# Altium project SterUni_V1.PrjPCB
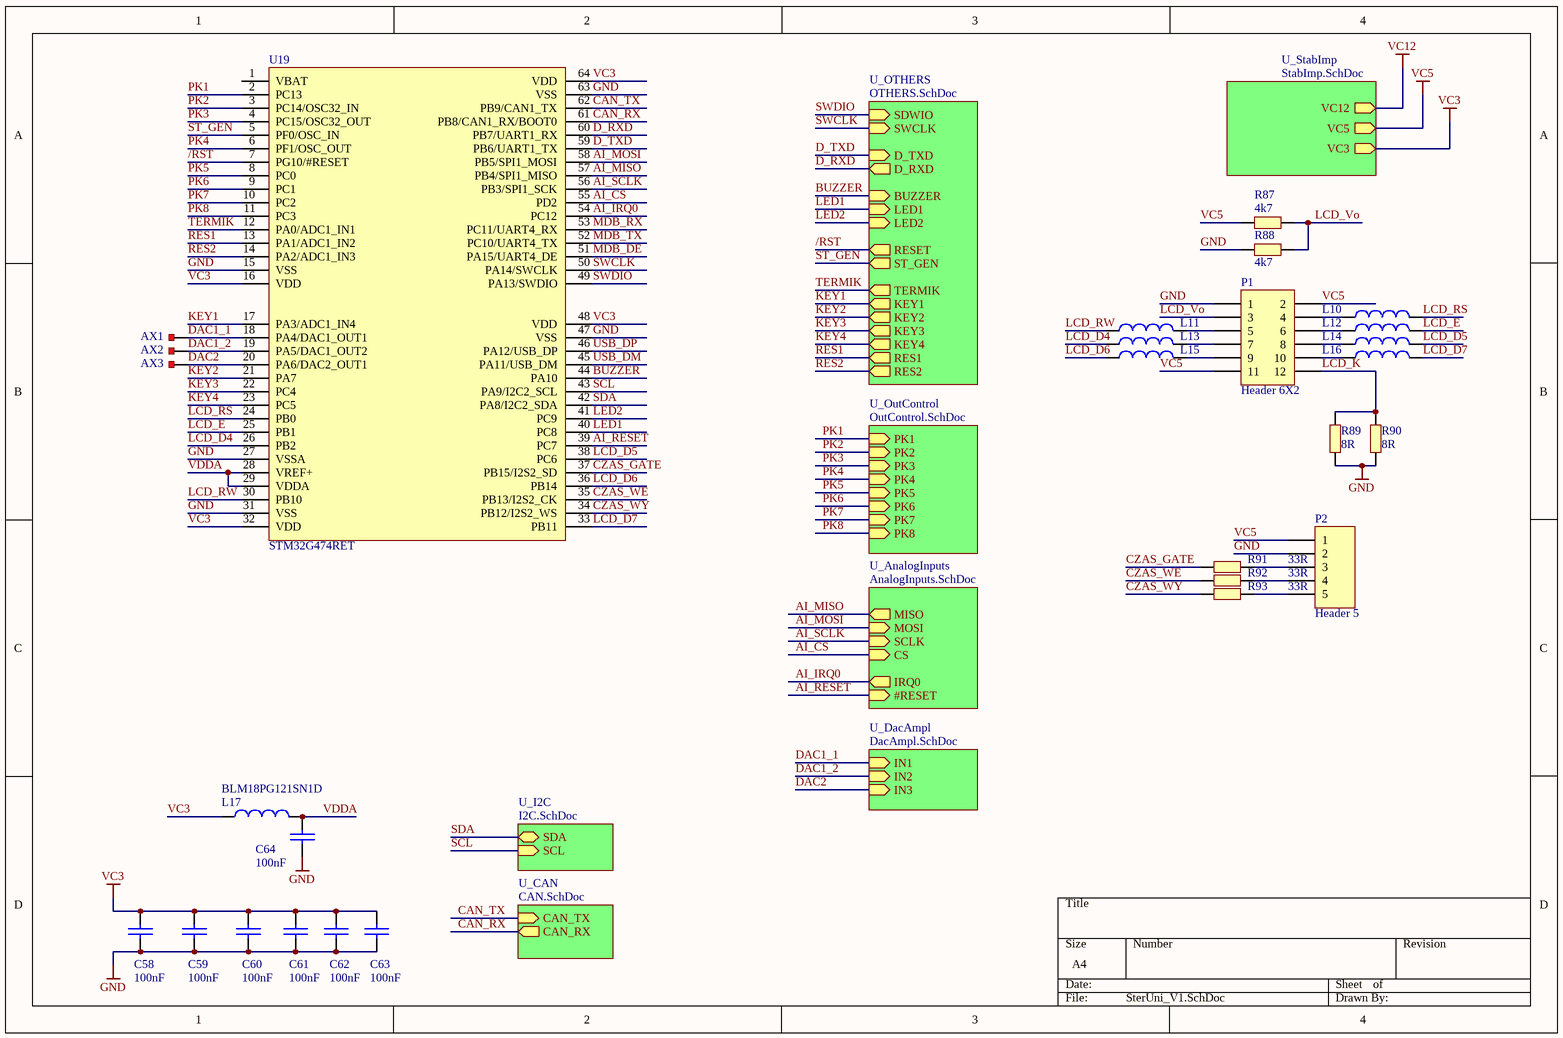
[diagram p0: SterUni_V1.SchDoc]
8 sheets, 255 parts. Net scope: hierarchical (ports join the sheet entries above them; power ports are global).
Board file: SterUni_V1.PcbDoc
Sheets:
  SterUni_V1.SchDoc
    U_OTHERS = OTHERS.SchDoc
    U_OutControl = OutControl.SchDoc
    U_StabImp = StabImp.SchDoc
    U_I2C = I2C.SchDoc
    U_CAN = CAN.SchDoc
    U_AnalogInputs = AnalogInputs.SchDoc
    U_DacAmpl = DacAmpl.SchDoc

## Sheet SterUni_V1.SchDoc
size A4

### Parts
AX1  (no value)  [PP_SMD4]
AX2  (no value)  [PP_SMD4]
AX3  (no value)  [PP_SMD4]
C58  100nF  [0603C]
C59  100nF  [0603C]
C60  100nF  [0603C]
C61  100nF  [0603C]
C62  100nF  [0603C]
C63  100nF  [0603C]
C64  100nF  [0603C]
L10  BLM18PG121SN1D  [0603L]  (value not drawn)
L11  BLM18PG121SN1D  [0603L]  (value not drawn)
L12  BLM18PG121SN1D  [0603L]  (value not drawn)
L13  BLM18PG121SN1D  [0603L]  (value not drawn)
L14  BLM18PG121SN1D  [0603L]  (value not drawn)
L15  BLM18PG121SN1D  [0603L]  (value not drawn)
L16  BLM18PG121SN1D  [0603L]  (value not drawn)
L17  BLM18PG121SN1D  [0603L]
P1  Header 6X2  [UMATCH-12]
P2  Header 5  [JST-B5B-XH-A]
R87  4k7  [0603R]
R88  4k7  [0603R]
R89  8R  [1206]
R90  8R  [1206]
R91  33R  [0603R]
R92  33R  [0603R]
R93  33R  [0603R]
U19  STM32G474RET  [LQFP64]

### Sub-sheets
U_AnalogInputs = AnalogInputs.SchDoc: MOSI (in), MISO (out), SCLK (in), CS (in), IRQ0 (out), #RESET (in)
U_CAN = CAN.SchDoc: CAN_RX (out), CAN_TX (in)
U_DacAmpl = DacAmpl.SchDoc: IN1 (in), IN2 (in), IN3 (in)
U_I2C = I2C.SchDoc: SCL (in), SDA (bidir)
U_OTHERS = OTHERS.SchDoc: SDWIO (in), SWCLK (in), D_TXD (in), D_RXD (out), RESET (out), LED1 (in), LED2 (in), ST_GEN (out), BUZZER (in), KEY1 (out), TERMIK (out), KEY2 (out), KEY3 (out), KEY4 (out), RES1 (out), RES2 (out)
U_OutControl = OutControl.SchDoc: PK1 (in), PK2 (in), PK3 (in), PK4 (in), PK5 (in), PK6 (in), PK7 (in), PK8 (in)
U_StabImp = StabImp.SchDoc: VC5 (out), VC3 (out), VC12 (out)

### Nets
GND: C58.2 C59.2 C60.2 C61.2 C62.2 C63.2 C64.2 P1.1 P2.2 R88.2 R89.2 R90.2 U19.15(VSS) U19.27(VSSA) U19.31(VSS) U19.47(VSS) U19.63(VSS)
VC3: C58.1 C59.1 C60.1 C61.1 C62.1 C63.1 L17.1 U19.16(VDD) U19.32(VDD) U19.48(VDD) U19.64(VDD) ; sheet U_StabImp/VC3
VC5: P1.2 P1.11 P2.1 R87.2 ; sheet U_StabImp/VC5
/RST: U19.7(PG10/#RESET) ; sheet U_OTHERS/RESET
AI_CS: U19.55(PD2) ; sheet U_AnalogInputs/CS
AI_IRQ0: U19.54(PC12) ; sheet U_AnalogInputs/IRQ0
AI_MISO: U19.57(PB4/SPI1_MISO) ; sheet U_AnalogInputs/MISO
AI_MOSI: U19.58(PB5/SPI1_MOSI) ; sheet U_AnalogInputs/MOSI
AI_RESET: U19.39(PC7) ; sheet U_AnalogInputs/#RESET
AI_SCLK: U19.56(PB3/SPI1_SCK) ; sheet U_AnalogInputs/SCLK
BUZZER: U19.44(PA10) ; sheet U_OTHERS/BUZZER
CAN_RX: U19.61(PB8/CAN1_RX/BOOT0) ; sheet U_CAN/CAN_RX
CAN_TX: U19.62(PB9/CAN1_TX) ; sheet U_CAN/CAN_TX
CZAS_GATE: R91.2 U19.37(PB15/I2S2_SD)
CZAS_WE: R92.2 U19.35(PB13/I2S2_CK)
CZAS_WY: R93.2 U19.34(PB12/I2S2_WS)
D_RXD: U19.60(PB7/UART1_RX) ; sheet U_OTHERS/D_RXD
D_TXD: U19.59(PB6/UART1_TX) ; sheet U_OTHERS/D_TXD
DAC1_1: AX1.1 U19.18(PA4/DAC1_OUT1) ; sheet U_DacAmpl/IN1
DAC1_2: AX2.1 U19.19(PA5/DAC1_OUT2) ; sheet U_DacAmpl/IN2
DAC2: AX3.1 U19.20(PA6/DAC2_OUT1) ; sheet U_DacAmpl/IN3
KEY1: U19.17(PA3/ADC1_IN4) ; sheet U_OTHERS/KEY1
KEY2: U19.21(PA7) ; sheet U_OTHERS/KEY2
KEY3: U19.22(PC4) ; sheet U_OTHERS/KEY3
KEY4: U19.23(PC5) ; sheet U_OTHERS/KEY4
LCD_D4: L13.1 U19.26(PB2)
LCD_D5: L14.2 U19.38(PC6)
LCD_D6: L15.1 U19.36(PB14)
LCD_D7: L16.2 U19.33(PB11)
LCD_E: L12.2 U19.25(PB1)
LCD_K: P1.12 R89.1 R90.1
LCD_RS: L10.2 U19.24(PB0)
LCD_RW: L11.1 U19.30(PB10)
LCD_Vo: P1.3 R87.1 R88.1
LED1: U19.40(PC8) ; sheet U_OTHERS/LED1
LED2: U19.41(PC9) ; sheet U_OTHERS/LED2
MDB_DE: U19.51(PA15/UART4_DE)
MDB_RX: U19.53(PC11/UART4_RX)
MDB_TX: U19.52(PC10/UART4_TX)
PK1: U19.2(PC13) ; sheet U_OutControl/PK1
PK2: U19.3(PC14/OSC32_IN) ; sheet U_OutControl/PK2
PK3: U19.4(PC15/OSC32_OUT) ; sheet U_OutControl/PK3
PK4: U19.6(PF1/OSC_OUT) ; sheet U_OutControl/PK4
PK5: U19.8(PC0) ; sheet U_OutControl/PK5
PK6: U19.9(PC1) ; sheet U_OutControl/PK6
PK7: U19.10(PC2) ; sheet U_OutControl/PK7
PK8: U19.11(PC3) ; sheet U_OutControl/PK8
RES1: U19.13(PA1/ADC1_IN2) ; sheet U_OTHERS/RES1
RES2: U19.14(PA2/ADC1_IN3) ; sheet U_OTHERS/RES2
SCL: U19.43(PA9/I2C2_SCL) ; sheet U_I2C/SCL
SDA: U19.42(PA8/I2C2_SDA) ; sheet U_I2C/SDA
ST_GEN: U19.5(PF0/OSC_IN) ; sheet U_OTHERS/ST_GEN
SWCLK: U19.50(PA14/SWCLK) ; sheet U_OTHERS/SWCLK
SWDIO: U19.49(PA13/SWDIO) ; sheet U_OTHERS/SDWIO
TERMIK: U19.12(PA0/ADC1_IN1) ; sheet U_OTHERS/TERMIK
USB_DM: U19.45(PA11/USB_DM)
USB_DP: U19.46(PA12/USB_DP)
VDDA: C64.1 L17.2 U19.28(VREF+) U19.29(VDDA)
NetL10_1: L10.1 P1.4
NetL11_2: L11.2 P1.5
NetL12_1: L12.1 P1.6
NetL13_2: L13.2 P1.7
NetL14_1: L14.1 P1.8
NetL15_2: L15.2 P1.9
NetL16_1: L16.1 P1.10
NetP2_3: P2.3 R91.1
NetP2_4: P2.4 R92.1
NetP2_5: P2.5 R93.1

Not connected (* = marked no-connect by the designer): U19 1(VBAT)

### Library data of the parts
AX1-AX3 = PP_RT
C58-C64 = CAP: Capacitor
L10-L17 = BEAD_120R_2A_0603: Bead,120R,2A,0603,BLM18PG121SN1D,MURATA; Manuf_Part_3: FCM1608KF-601T03; Manuf_2: TDK; Manuf_Part_2: MPZ1608S300A; Manuf_3: Tai-tech; Value: 100uH; Description_3: Bead,600R,350mA,0603,FCM1608KF-601T03,Tai-tech; Description_2: Bead,30R,5A,0603,MPZ1608S300A,TDK; Revision: July-2002: Re-released for DXP Platform.; ECCN_US/EU: n/a; Manuf_Part_1: BLM18PG121SN1D; Manuf_1: MURATA
P1 = Header 6X2: Header, 6-Pin, Dual row; LatestRevisionDate: 17-Jul-2002; LatestRevisionNote: Re-released for DXP Platform.; Publisher: Altium Limited
P2 = Header 5: Header, 5-Pin; LatestRevisionDate: 17-Jul-2002; LatestRevisionNote: Re-released for DXP Platform.; Publisher: Altium Limited
R87-R93 = RES3
U19 = STM32FG474RET

## Sheet OTHERS.SchDoc
size A4
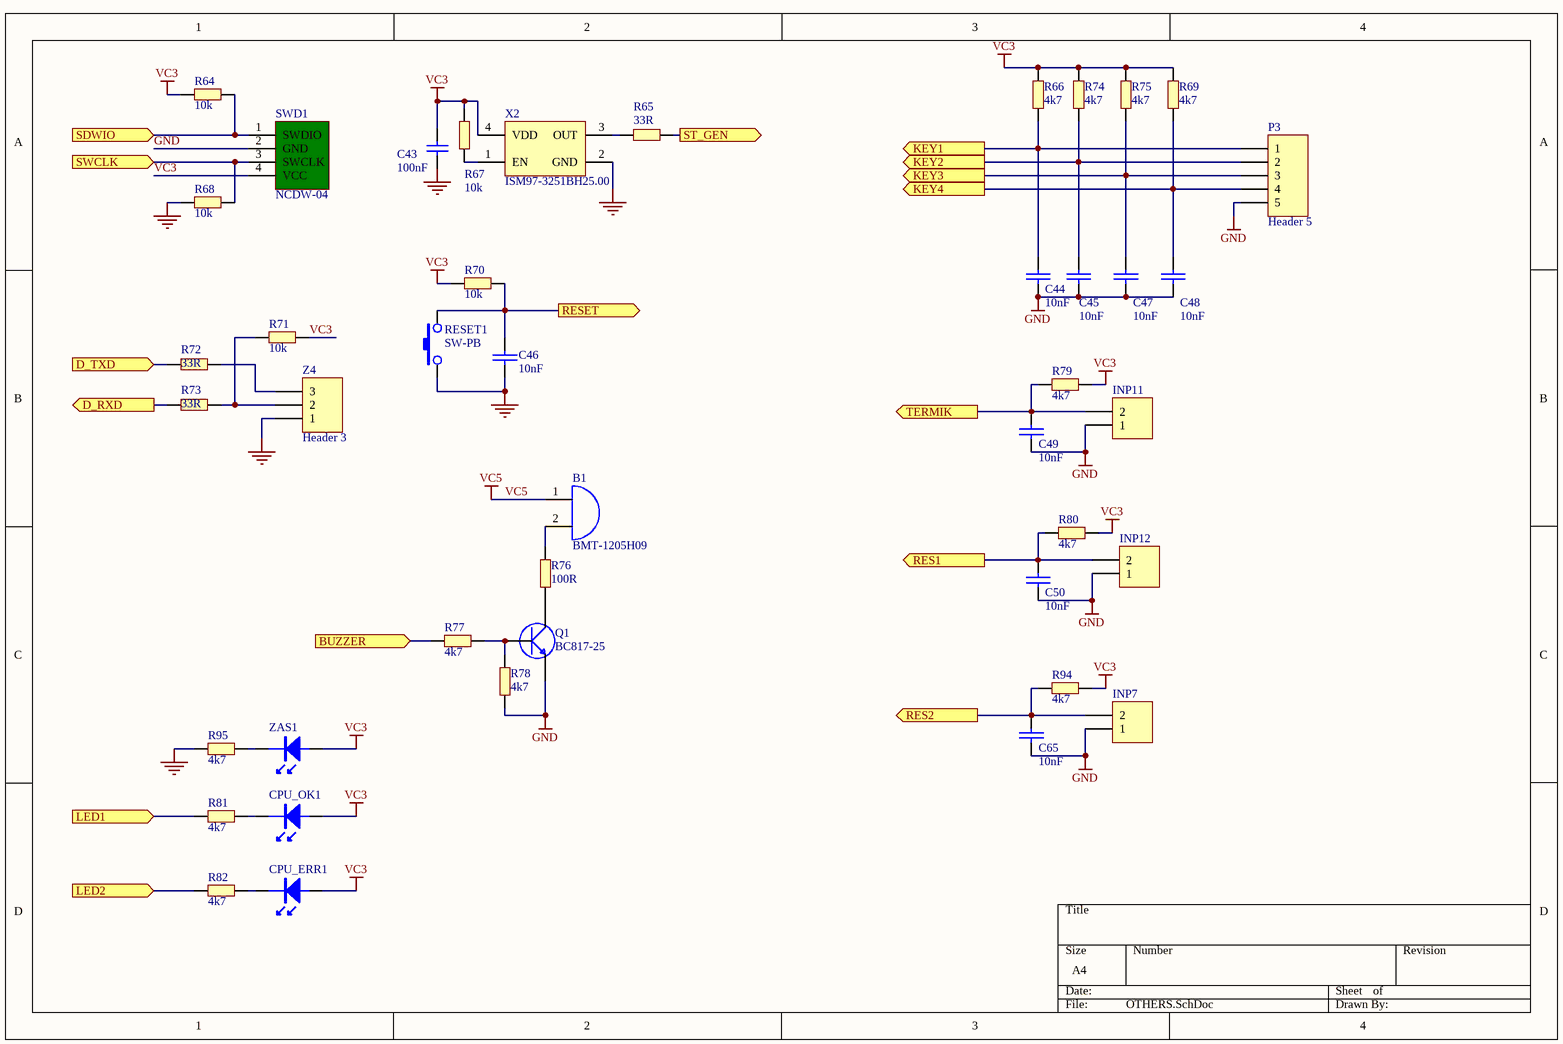
[diagram p1: OTHERS.SchDoc]

### Parts
B1  BMT-1205H09  [BMT-1205H09]
C43  100nF  [0603C]
C44  10nF  [0603C]
C45  10nF  [0603C]
C46  10nF  [0603C]
C47  10nF  [0603C]
C48  10nF  [0603C]
C49  10nF  [0603C]
C50  10nF  [0603C]
C65  10nF  [0603C]
CPU_ERR1  LED0805  [0603DR]  (value not drawn)
CPU_OK1  green  [0603DG]  (value not drawn)
INP7  Header 2  [JST-XH-2Y-2.54]  (value not drawn)
INP11  Header 2  [JST-XH-2Y-2.54]  (value not drawn)
INP12  Header 2  [JST-XH-2Y-2.54]  (value not drawn)
P3  Header 5  [JST-B5B-XH-A]
Q1  BC817-25  [SOT23-3Q]
R64  10k  [0603R]
R65  33R  [0603R]
R66  4k7  [0603R]
R67  10k  [0603R]
R68  10k  [0603R]
R69  4k7  [0603R]
R70  10k  [0603R]
R71  10k  [0603R]
R72  33R  [0603R]
R73  33R  [0603R]
R74  4k7  [0603R]
R75  4k7  [0603R]
R76  100R  [0603R]
R77  4k7  [0603R]
R78  4k7  [0603R]
R79  4k7  [0603R]
R80  4k7  [0603R]
R81  4k7  [0603R]
R82  4k7  [0603R]
R94  4k7  [0603R]
R95  4k7  [0603R]
RESET1  SW-PB  [DTSM31N_2]
SWD1  NCDW-04  [PIN4]
X2  ISM97-3251BH25.00  [GEN_SMD1_1]
Z4  Header 3  [PIN3]
ZAS1  green  [0603DG]  (value not drawn)

### Ports
BUZZER (in), D_RXD (out), D_TXD (in), KEY1 (out), KEY2 (out), KEY3 (out), KEY4 (out), LED1 (in), LED2 (in), RES1 (out), RES2 (out), RESET (out), SDWIO (in), ST_GEN (out), SWCLK (in), TERMIK (out)

### Nets
GND: C43.1 C44.2 C45.2 C46.2 C47.2 C48.2 C49.2 C50.2 C65.2 INP7.1 INP11.1 INP12.1 P3.5 Q1.E R68.1 R78.2 R95.2 RESET1.1 SWD1.2(GND) X2.2(GND) Z4.1
VC3: C43.2 CPU_ERR1.A CPU_OK1.A R64.1 R66.2 R67.1 R69.2 R70.1 R71.2 R74.2 R75.2 R79.2 R80.2 R94.2 SWD1.4(VCC) X2.4(VDD) ZAS1.A
VC5: B1.1
/RST: C46.1 R70.2 RESET1.2 ; port RESET
BUZZER: R77.2 ; port BUZZER
D_RXD: R73.2 ; port D_RXD
D_TXD: R72.2 ; port D_TXD
KEY1: C44.1 P3.1 R66.1 ; port KEY1
KEY2: C45.1 P3.2 R74.1 ; port KEY2
KEY3: C47.1 P3.3 R75.1 ; port KEY3
KEY4: C48.1 P3.4 R69.1 ; port KEY4
LED1: R81.2 ; port LED1
LED2: R82.2 ; port LED2
RES1: C50.1 INP12.2 R80.1 ; port RES1
RES2: C65.1 INP7.2 R94.1 ; port RES2
ST_GEN: R65.2 ; port ST_GEN
SWCLK: R68.2 SWD1.3(SWCLK) ; port SWCLK
SWDIO: R64.2 SWD1.1(SWDIO) ; port SDWIO
TERMIK: C49.1 INP11.2 R79.1 ; port TERMIK
NetB1_2: B1.2 R76.1
NetCPU_ERR1_K: CPU_ERR1.K R82.1
NetCPU_OK1_K: CPU_OK1.K R81.1
NetQ1_B: Q1.B R77.1 R78.1
NetQ1_C: Q1.C R76.2
NetR65_1: R65.1 X2.3(OUT)
NetR67_2: R67.2 X2.1(EN)
NetR71_1: R71.1 R73.1 Z4.2
NetR72_1: R72.1 Z4.3
NetR95_1: R95.1 ZAS1.K

### Library data of the parts
B1 = BUZZER
C43 = Cap_100nF_X7R_10%_0402: Capacitor,100nF,16V,X7R,10%,0402,YAGEO; Manuf_Part_1: CC0402KRX7R7BB104; Revision: July-2002: Re-released for DXP Platform.; Value: 100nF; Order: CC0402KRX7R7BB104; Manuf_1: YAGEO
C44-C50 C65 = CAP: Capacitor
CPU_ERR1 CPU_OK1 ZAS1 = LED1206
INP7 INP11 INP12 = Header 2: Header, 2-Pin; LatestRevisionDate: 17-Jul-2002; LatestRevisionNote: Re-released for DXP Platform.; Publisher: Altium Limited
P3 = Header 5: Header, 5-Pin; LatestRevisionDate: 17-Jul-2002; LatestRevisionNote: Re-released for DXP Platform.; Publisher: Altium Limited
Q1 = S9013SMD
R64-R82 R94 R95 = RES3
SWD1 = SW_CON: Header, 4-Pin; LatestRevisionDate: 17-Jul-2002; LatestRevisionNote: Re-released for DXP Platform.; Publisher: Altium Limited
X2 = OSC_25M_NZ2520SB: Oscillator 25.00Mhz, -+50PPM, 3.3V, Temp -55 to +125°C; Manuf_Part_1: NZ2520SB 25MHz END4869B; Manuf_1: NDK; Manuf_Part_2: KC2520B25.0000C10E00; Manuf_2: AVX Corp/Kyocera Corp; ECCN_US/EU: EAR99/NEC; Ref St: 9157031; Provided: ST; Dostawca: TME; Order: *; Dostawca.Symbol: ISM97-3251BH25.00
Z4 = Header 3: Header, 3-Pin; LatestRevisionDate: 17-Jul-2002; LatestRevisionNote: Re-released for DXP Platform.; Publisher: Altium Limited

## Sheet OutControl.SchDoc
size A4
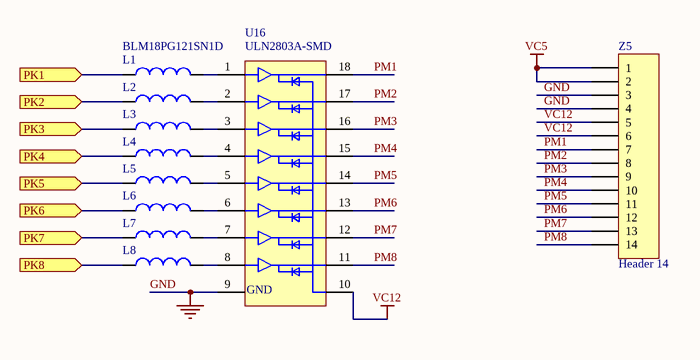
[diagram p2: OutControl.SchDoc]

### Parts
L1  BLM18PG121SN1D  [0603L]
L2  BLM18PG121SN1D  [0603L]  (value not drawn)
L3  BLM18PG121SN1D  [0603L]  (value not drawn)
L4  BLM18PG121SN1D  [0603L]  (value not drawn)
L5  BLM18PG121SN1D  [0603L]  (value not drawn)
L6  BLM18PG121SN1D  [0603L]  (value not drawn)
L7  BLM18PG121SN1D  [0603L]  (value not drawn)
L8  BLM18PG121SN1D  [0603L]  (value not drawn)
U16  ULN2803A-SMD  [SOL18]
Z5  Header 14  [UMATCH-14]

### Ports
PK1 (in), PK2 (in), PK3 (in), PK4 (in), PK5 (in), PK6 (in), PK7 (in), PK8 (in)

### Nets
GND: U16.9 Z5.3 Z5.4
VC5: Z5.1 Z5.2
VC12: U16.10 Z5.5 Z5.6
PK1: L1.1 ; port PK1
PK2: L2.1 ; port PK2
PK3: L3.1 ; port PK3
PK4: L4.1 ; port PK4
PK5: L5.1 ; port PK5
PK6: L6.1 ; port PK6
PK7: L7.1 ; port PK7
PK8: L8.1 ; port PK8
PM1: U16.18 Z5.7
PM2: U16.17 Z5.8
PM3: U16.16 Z5.9
PM4: U16.15 Z5.10
PM5: U16.14 Z5.11
PM6: U16.13 Z5.12
PM7: U16.12 Z5.13
PM8: U16.11 Z5.14
NetL1_2: L1.2 U16.1
NetL2_2: L2.2 U16.2
NetL3_2: L3.2 U16.3
NetL4_2: L4.2 U16.4
NetL5_2: L5.2 U16.5
NetL6_2: L6.2 U16.6
NetL7_2: L7.2 U16.7
NetL8_2: L8.2 U16.8

### Notes on the sheet
- (in symbol ULN2803) GND

### Library data of the parts
L1-L8 = BEAD_120R_2A_0603: as L10 on sheet SterUni_V1; Revision: July-2002: Re-released for DXP Platform.; ECCN_US/EU: n/a; Manuf_Part_1: BLM18PG121SN1D; Manuf_1: MURATA
U16 = ULN2803
Z5 = Header 14: Header, 14-Pin; LatestRevisionDate: 17-Jul-2002; LatestRevisionNote: Re-released for DXP Platform.; Publisher: Altium Limited

## Sheet StabImp.SchDoc
size A4
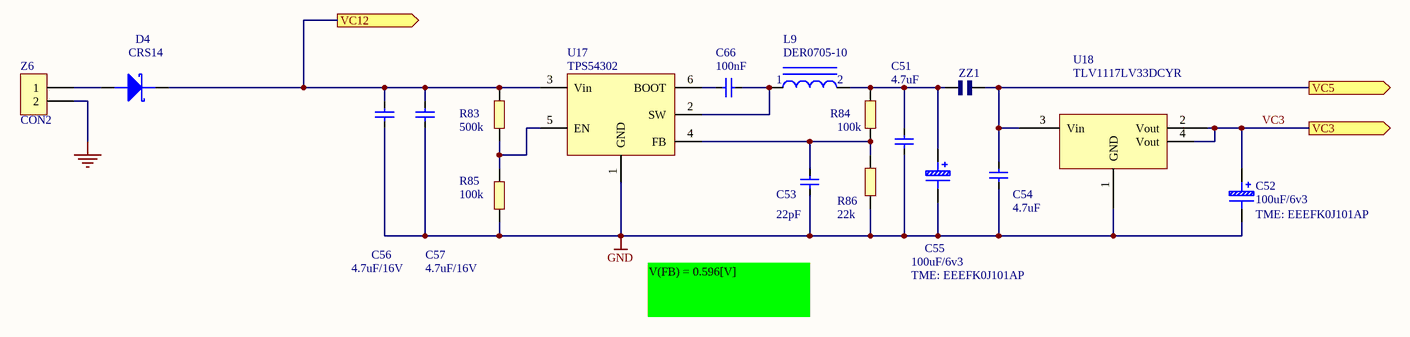
[diagram p3: StabImp.SchDoc]

### Parts
C51  4.7uF  [0805C]
C52  100uF/6v3  [CAP_SMD_ELEK_D]
C53  22pF  [0603C]
C54  4.7uF  [0805C]
C55  100uF/6v3  [CAP_SMD_ELEK_D]
C56  4.7uF/16V  [0805C]
C57  4.7uF/16V  [0805C]
C66  100nF  [0603C]
D4  CRS14  [1206D]
L9  DER0705-10  [DER0705_1]
R83  500k  [0603R]
R84  100k  [0603R]
R85  100k  [0603R]
R86  22k  [0603R]
U17  TPS54302  [SOT-23-1.1]
U18  TLV1117LV33DCYR  [SOT223]
Z6  CON2  [ARC-2-5.08]
ZZ1  ZWORA  [ZW3]  (value not drawn)

### Ports
VC3 (out), VC5 (out), VC12 (out)

### Nets
GND: C51.1 C52.1 C53.1 C54.1 C55.1 C56.1 C57.1 R85.2 R86.2 U17.1(GND) U18.1(GND) Z6.2
VC3: C52.2 U18.2(Vout) U18.4(Vout) ; port VC3
VC5: C54.2 U18.3(Vin) ZZ1.2 ; port VC5
VC12: C56.2 C57.2 D4.K R83.1 U17.3(Vin) ; port VC12
NetC51_2: C51.2 C55.2 L9.2 R84.1 ZZ1.1
NetC53_2: C53.2 R84.2 R86.1 U17.4(FB)
NetC66_1: C66.1 L9.1 U17.2(SW)
NetC66_2: C66.2 U17.6(BOOT)
NetD4_A: D4.A Z6.1
NetR83_2: R83.2 R85.1 U17.5(EN)

### Notes on the sheet
- V(FB) = 0.596[V]

### Library data of the parts
C51 C53 C54 C56 C57 C66 = CAP
C52 C55 = CapTantal: EEEFK0J101AP; TME: EEEFK0J101AP
D4 = DIODE SCHOTTKY: Schottky Diode; Dostawca: TME; Dostawca.Symbol: CRS14
L9 = CEWKA_1: Dostawca.Symbol: DER0705-15; Dostawca: TME
R83-R86 = RES3
U18 = LD1117V33: Dostawca.Symbol: LD1117DT33; Dostawca: TME
Z6 = CON2: Connector

## Sheet I2C.SchDoc
size A4
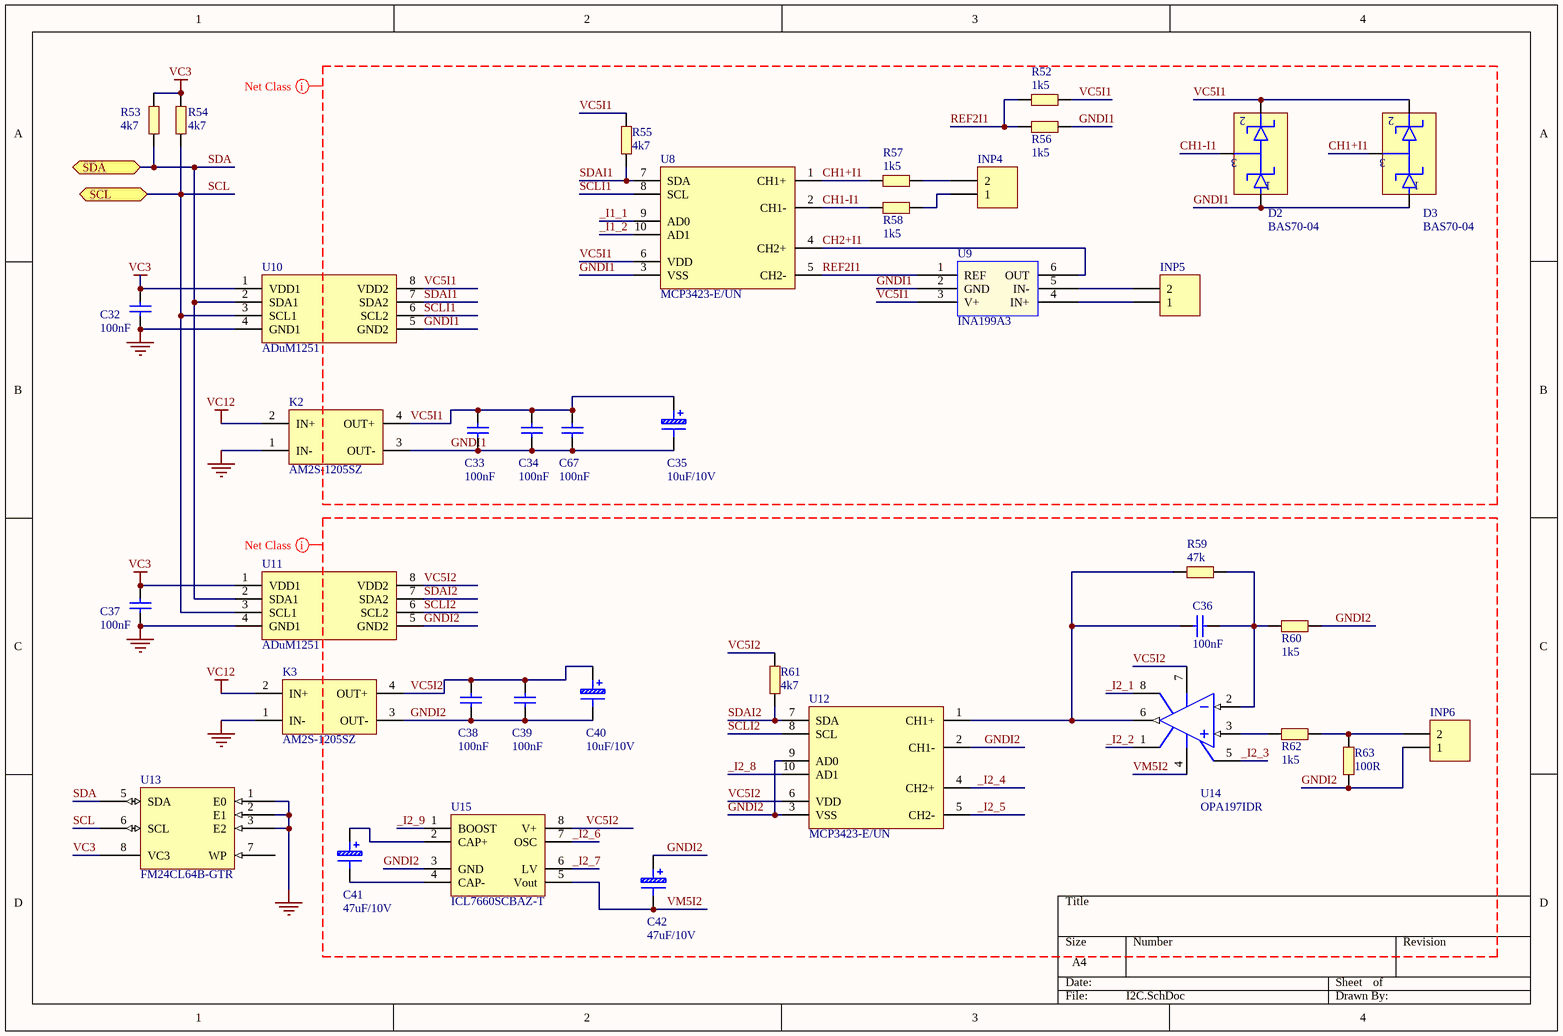
[diagram p4: I2C.SchDoc]

### Parts
C32  100nF  [0603C]
C33  100nF  [0603C]
C34  100nF  [0603C]
C35  10uF/10V  [CAP_A]
C36  100nF  [0603C]
C37  100nF  [0603C]
C38  100nF  [0603C]
C39  100nF  [0603C]
C40  10uF/10V  [CAP_A]
C41  47uF/10V  [CAP_C]
C42  47uF/10V  [CAP_C]
C67  100nF  [0603C]
D2  BAS70-04  [SOT-23]
D3  BAS70-04  [SOT-23]
INP4  Header 2  [JST-XH-2Y-2.54]  (value not drawn)
INP5  Header 2  [JST-XH-2Y-2.54]  (value not drawn)
INP6  Header 2  [JST-XH-2Y-2.54]  (value not drawn)
K2  AM2S-1205SZ  [DCDC_SIL4]
K3  AM2S-1205SZ  [DCDC_SIL4]
R52  1k5  [0603R]
R53  4k7  [0603R]
R54  4k7  [0603R]
R55  4k7  [0603R]
R56  1k5  [0603R]
R57  1k5  [0603R]
R58  1k5  [0603R]
R59  47k  [0603R]
R60  1k5  [0603R]
R61  4k7  [0603R]
R62  1k5  [0603R]
R63  100R  [0603R]
U8  MCP3423-E/UN  [MSOP10_1]
U9  INA199A3  [SC70-6]
U10  ADuM1251  [SO8]
U11  ADuM1251  [SO8]
U12  MCP3423-E/UN  [MSOP10_1]
U13  FM24CL64B-GTR  [SO8]
U14  OPA197IDR  [SO8]
U15  ICL7660SCBAZ-T  [SO8]

### Ports
SCL (bidir), SDA (bidir)

### Nets
GND: C32.1 C37.1 K2.1(IN-) K3.1(IN-) U10.4(GND1) U11.4(GND1) U13.1(E0) U13.2(E1) U13.3(E2) U13.4(GND)
VC3: C32.2 C37.2 R53.1 R54.1 U10.1(VDD1) U11.1(VDD1) U13.8(VC3)
VC12: K2.2(IN+) K3.2(IN+)
_I1_1: U8.9(AD0)
_I1_2: U8.10(AD1)
_I2_1: U14.8(TAB)
_I2_2: U14.1(OS_NUL)
_I2_3: U14.5(OS_NUL)
_I2_4: U12.4(CH2+)
_I2_5: U12.5(CH2-)
_I2_6: U15.7(OSC)
_I2_7: U15.6(LV)
_I2_8: U12.10(AD1)
_I2_9: U15.1(BOOST)
CH1+I1: D3.3 R57.1 U8.1(CH1+)
CH1-I1: D2.3 R58.1 U8.2(CH1-)
CH2+I1: U8.4(CH2+) U9.6(OUT)
GNDI1: C33.1 C34.1 C35.1 C67.1 D2.1 D3.1 K2.3(OUT-) R56.2 U8.3(VSS) U9.2(GND) U10.5(GND2)
GNDI2: C38.1 C39.1 C40.1 C42.2 INP6.1 K3.3(OUT-) R60.2 R63.1 U11.5(GND2) U12.2(CH1-) U12.3(VSS) U12.9(AD0) U15.3(GND)
REF2I1: R52.1 R56.1 U8.5(CH2-) U9.1(REF)
SCL: R54.2 U10.3(SCL1) U11.3(SCL1) U13.6(SCL) ; port SCL
SCLI1: U8.8(SCL) U10.6(SCL2)
SCLI2: U11.6(SCL2) U12.8(SCL)
SDA: R53.2 U10.2(SDA1) U11.2(SDA1) U13.5(SDA) ; port SDA
SDAI1: R55.1 U8.7(SDA) U10.7(SDA2)
SDAI2: R61.1 U11.7(SDA2) U12.7(SDA)
VC5I1: C33.2 C34.2 C35.2 C67.2 D2.2 D3.2 K2.4(OUT+) R52.2 R55.2 U8.6(VDD) U9.3(V+) U10.8(VDD2)
VC5I2: C38.2 C39.2 C40.2 K3.4(OUT+) R61.2 U11.8(VDD2) U12.6(VDD) U14.7(V+) U15.8(V+)
VM5I2: C42.1 U14.4(V-) U15.5(Vout)
NetC36_1: C36.1 R59.2 R60.1 U14.2(IN-)
NetC36_2: C36.2 R59.1 U12.1(CH1+) U14.6(OUT)
NetC41_1: C41.1 U15.4(CAP-)
NetC41_2: C41.2 U15.2(CAP+)
NetINP4_1: INP4.1 R58.2
NetINP4_2: INP4.2 R57.2
NetINP5_1: INP5.1 U9.4(IN+)
NetINP5_2: INP5.2 U9.5(IN-)
NetINP6_2: INP6.2 R62.2 R63.2
NetR62_1: R62.1 U14.3(IN+)

Not connected (* = marked no-connect by the designer): U13 7(WP)

### Layout directives
net class Izol_1: _I1_1, _I1_2, CH1+I1, CH1-I1, CH2+I1, GNDI1, REF2I1, SCLI1, SDAI1, VC5I1
net class Izol_2: _I2_1, _I2_2, _I2_3, _I2_4, _I2_5, _I2_6, _I2_7, _I2_8, _I2_9, GNDI2, SCLI2, SDAI2, VC5I2, VM5I2

### Library data of the parts
C32-C34 C36-C39 C67 = Cap_100nF_X7R_10%_0402: as C43 on sheet OTHERS; Revision: July-2002: Re-released for DXP Platform.; Value: 100nF; Order: CC0402KRX7R7BB104; Manuf_1: YAGEO
C35 C40-C42 = CapTantal
INP4-INP6 = Header 2: Header, 2-Pin; LatestRevisionDate: 17-Jul-2002; LatestRevisionNote: Re-released for DXP Platform.; Publisher: Altium Limited
K2 K3 = DCDC_SIL
R52-R63 = RES3
U8 U12 = MCP3423
U9 = INA199: Dostawca.Symbol: INA199A3DCKT; Dostawca: TME
U10 U11 = ADuM1251: ADuM1251ARZ
U13 = AT24C02
U14 = Op Amp: FET Operational Amplifier; Published: 8-Jun-2000; LatestRevisionDate: 17-Jul-2002; LatestRevisionNote: Re-released for DXP Platform.; DatasheetVersion: REV. B; PackageVersion: 1990; PackageReference: H-08A; Publisher: Altium Limited; PackageDescription: Can; 8 Leads; Pin Circle Dia. 5.08 mm; Lead Dia. 0.53 mm (max); ComponentLink1Description: Manufacturer Link; ComponentLink1URL: http://www.analog.com/
U15 = ICL7660

## Sheet CAN.SchDoc
size A4
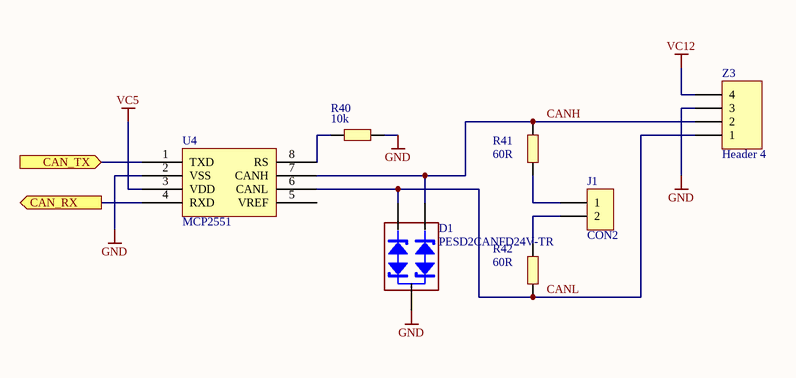
[diagram p5: CAN.SchDoc]

### Parts
D1  PESD2CANFD24V-TR  [SOT23]
J1  CON2  [PIN2]
R40  10k  [0603R]
R41  60R  [1206]
R42  60R  [1206]
U4  MCP2551  [SO8]
Z3  Header 4  [JST-B4B-XH-A]

### Ports
CAN_RX (out), CAN_TX (in)

### Nets
GND: D1.3(CC) R40.2 U4.2(VSS) Z3.3
VC5: U4.3(VDD)
VC12: Z3.4
CAN_RX: U4.4(RXD) ; port CAN_RX
CAN_TX: U4.1(TXD) ; port CAN_TX
CANH: D1.1(K1) R41.2 U4.7(CANH) Z3.2
CANL: D1.2(K2) R42.1 U4.6(CANL) Z3.1
NetJ1_1: J1.1 R41.1
NetJ1_2: J1.2 R42.2
NetR40_1: R40.1 U4.8(RS)

Not connected (* = marked no-connect by the designer): U4 5(VREF)

### Library data of the parts
J1 = CON2: Connector
R40-R42 = RES3
Z3 = Header 4: Header, 4-Pin; LatestRevisionDate: 17-Jul-2002; LatestRevisionNote: Re-released for DXP Platform.; Publisher: Altium Limited

## Sheet AnalogInputs.SchDoc
size A3
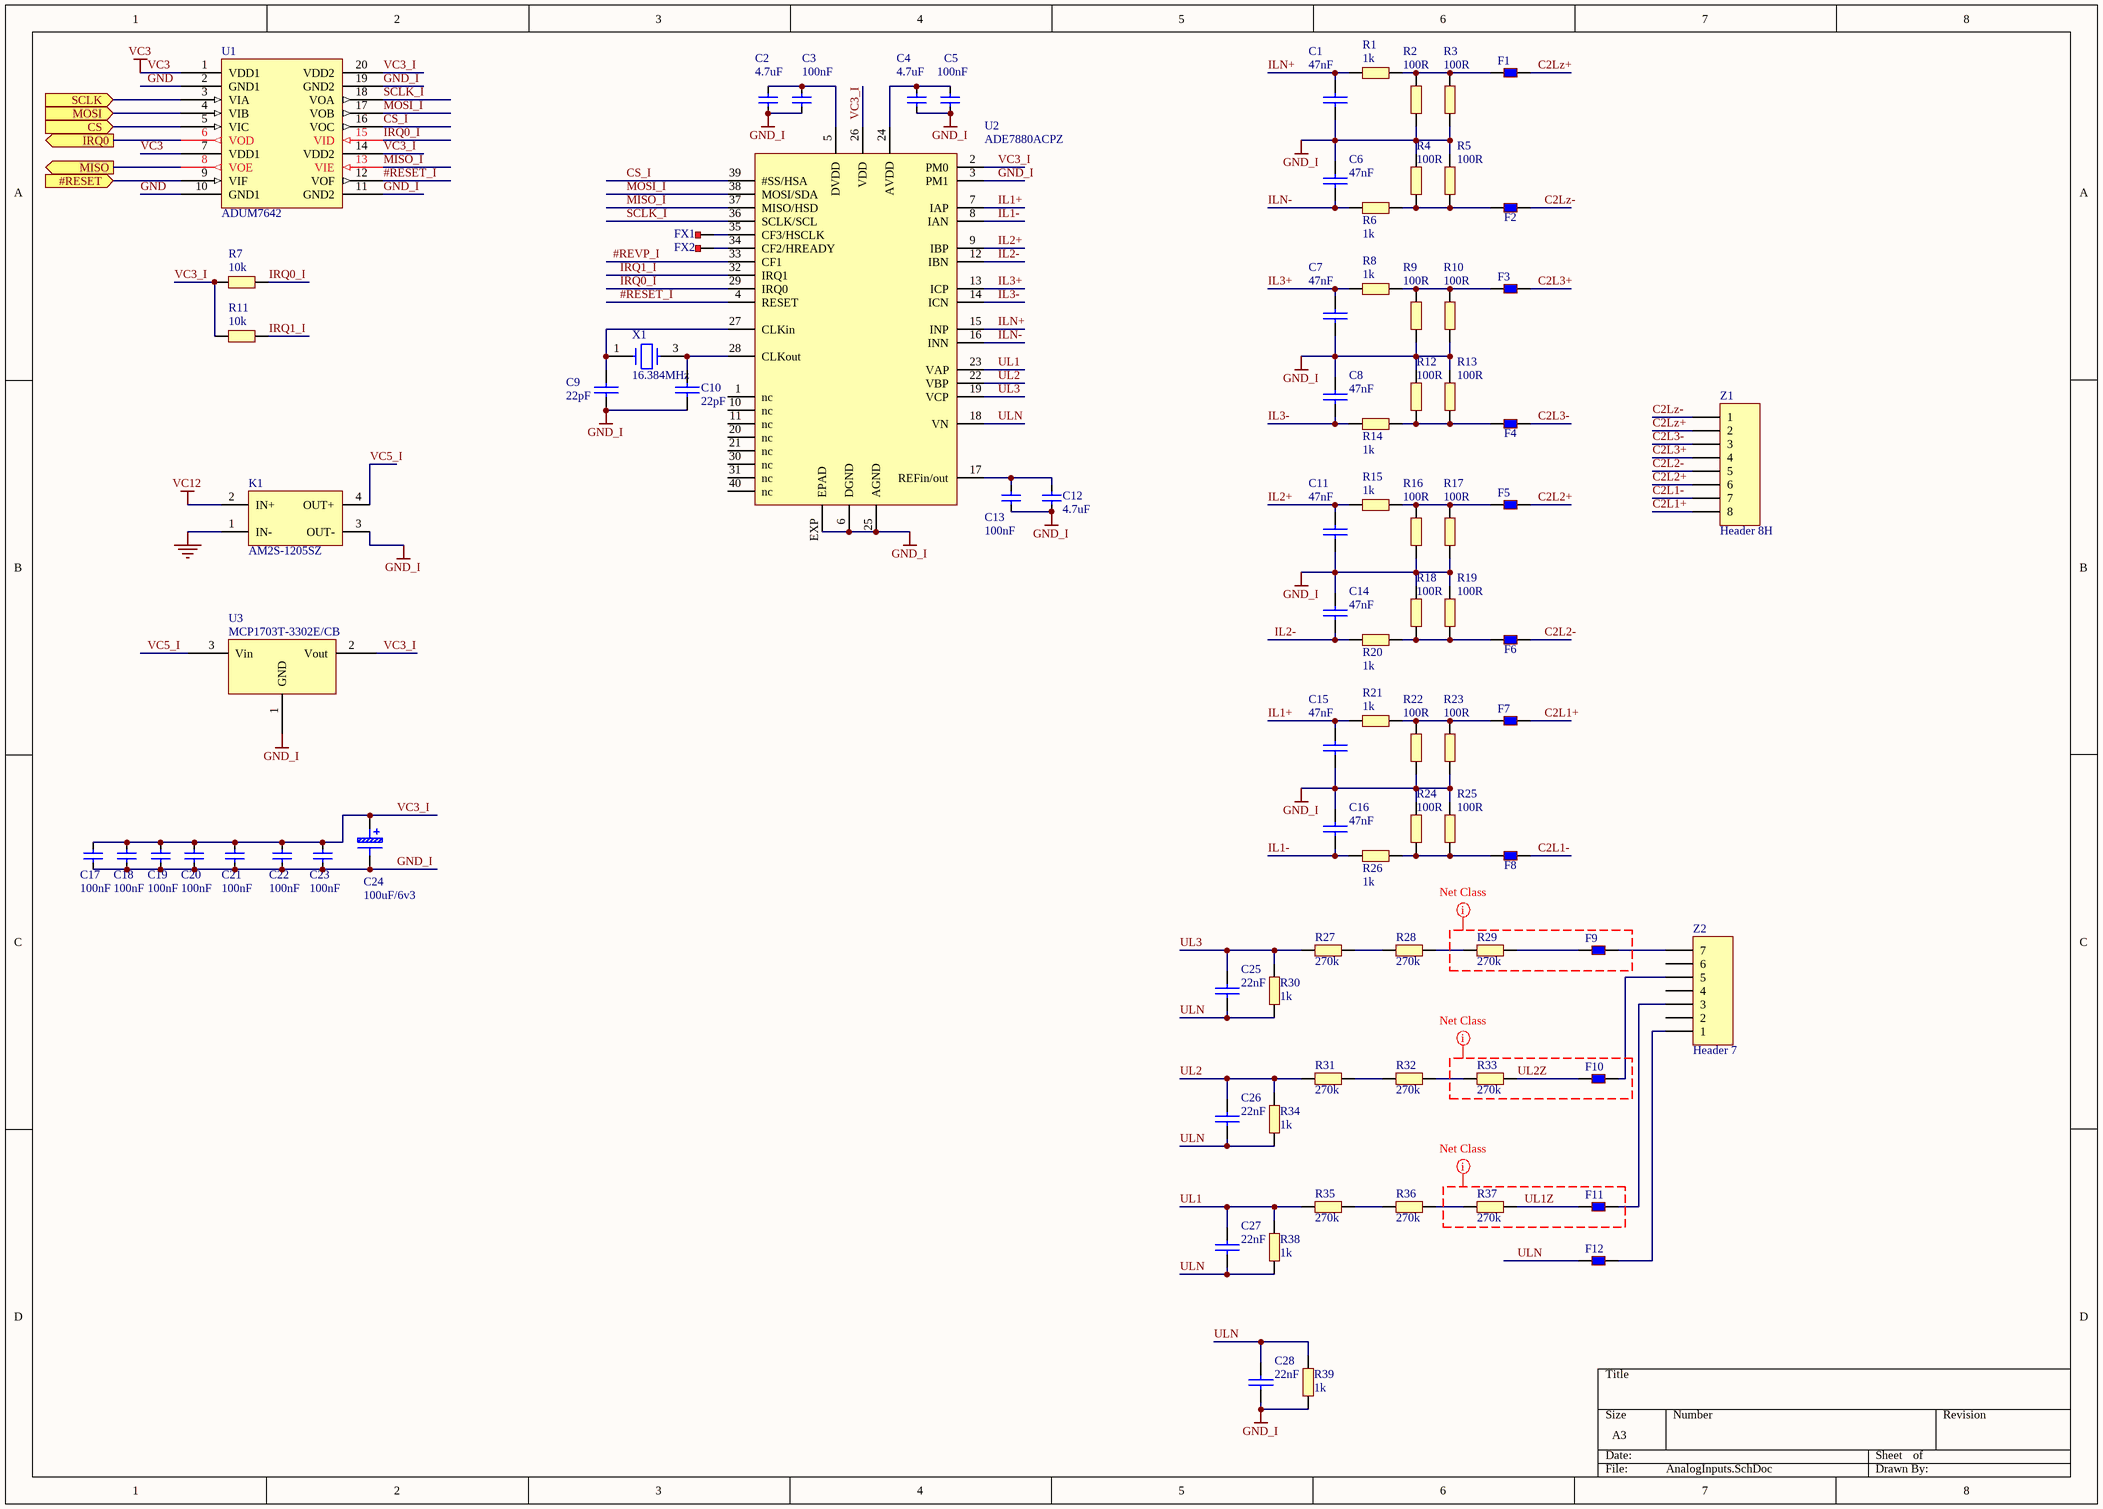
[diagram p6: AnalogInputs.SchDoc]

### Parts
C1  47nF  [0603C]
C2  4.7uF  [0603C]
C3  100nF  [0603C]
C4  4.7uF  [0603C]
C5  100nF  [0603C]
C6  47nF  [0603C]
C7  47nF  [0603C]
C8  47nF  [0603C]
C9  22pF  [0603C]
C10  22pF  [0603C]
C11  47nF  [0603C]
C12  4.7uF  [0603C]
C13  100nF  [0603C]
C14  47nF  [0603C]
C15  47nF  [0603C]
C16  47nF  [0603C]
C17  100nF  [0603C]
C18  100nF  [0603C]
C19  100nF  [0603C]
C20  100nF  [0603C]
C21  100nF  [0603C]
C22  100nF  [0603C]
C23  100nF  [0603C]
C24  100uF/6v3  [CAP_C]
C25  22nF  [0603C]
C26  22nF  [0603C]
C27  22nF  [0603C]
C28  22nF  [0603C]
F1  BLM18BB141SN1D  [0603L]  (value not drawn)
F2  BLM18BB141SN1D  [0603L]  (value not drawn)
F3  BLM18BB141SN1D  [0603L]  (value not drawn)
F4  BLM18BB141SN1D  [0603L]  (value not drawn)
F5  BLM18BB141SN1D  [0603L]  (value not drawn)
F6  BLM18BB141SN1D  [0603L]  (value not drawn)
F7  BLM18BB141SN1D  [0603L]  (value not drawn)
F8  BLM18BB141SN1D  [0603L]  (value not drawn)
F9  BLM18BB141SN1D  [0603L]  (value not drawn)
F10  BLM18BB141SN1D  [0603L]  (value not drawn)
F11  BLM18BB141SN1D  [0603L]  (value not drawn)
F12  BLM18BB141SN1D  [0603L]  (value not drawn)
FX1  (no value)  [PP_SMD4]
FX2  (no value)  [PP_SMD4]
K1  AM2S-1205SZ  [DCDC_SIL4]
R1  1k  [0603R]
R2  100R  [1206RM]
R3  100R  [AXIAL_0.25W_1]
R4  100R  [1206RM]
R5  100R  [AXIAL_0.25W_1]
R6  1k  [0603R]
R7  10k  [0603R]
R8  1k  [0603R]
R9  100R  [1206RM]
R10  100R  [AXIAL_0.25W_1]
R11  10k  [0603R]
R12  100R  [1206RM]
R13  100R  [AXIAL_0.25W_1]
R14  1k  [0603R]
R15  1k  [0603R]
R16  100R  [1206RM]
R17  100R  [AXIAL_0.25W_1]
R18  100R  [1206RM]
R19  100R  [AXIAL_0.25W_1]
R20  1k  [0603R]
R21  1k  [0603R]
R22  100R  [1206RM]
R23  100R  [AXIAL_0.25W_1]
R24  100R  [1206RM]
R25  100R  [AXIAL_0.25W_1]
R26  1k  [0603R]
R27  270k  [1206]
R28  270k  [1206]
R29  270k  [1206]
R30  1k  [0805R]
R31  270k  [1206]
R32  270k  [1206]
R33  270k  [1206]
R34  1k  [0805R]
R35  270k  [1206]
R36  270k  [1206]
R37  270k  [1206]
R38  1k  [0805R]
R39  1k  [0805R]
U1  ADUM7642  [RQ-20]
U2  ADE7880ACPZ  [LFCSP_WQ40]
U3  MCP1703T-3302E/CB  [SOT-23]
X1  16.384MHz  [XTAL_2.5_2]
Z1  Header 8H  [JST-B8B-XH-A]
Z2  Header 7  [JST-B7B-XH-A]

### Ports
#RESET (in), CS (in), IRQ0 (out), MISO (out), MOSI (in), SCLK (in)

### Nets
GND: K1.1(IN-) U1.2(GND1) U1.10(GND1)
GND_I: C1.2 C2.1 C3.1 C4.1 C5.1 C6.2 C7.2 C8.2 C9.1 C10.1 C11.2 C12.1 C13.1 C14.2 C15.2 C16.2 C17.1 C18.1 C19.1 C20.1 C21.1 C22.1 C23.1 C24.1 C28.1 K1.3(OUT-) R2.2 R3.2 R4.2 R5.2 R9.2 R10.2 R12.2 R13.2 R16.2 R17.2 R18.2 R19.2 R22.2 R23.2 R24.2 R25.2 R39.1 U1.11(GND2) U1.19(GND2) U2.3(PM1) U2.6(DGND) U2.25(AGND) U2.EXP(EPAD) U3.1(GND)
VC3: U1.1(VDD1) U1.7(VDD1)
VC12: K1.2(IN+)
#RESET_I: U1.12(VOF) U2.4(RESET)
#REVP_I: U2.33(CF1)
AI_CS: U1.5(VIC) ; port CS
AI_IRQ0: U1.6(VOD) ; port IRQ0
AI_MISO: U1.8(VOE) ; port MISO
AI_MOSI: U1.4(VIB) ; port MOSI
AI_RESET: U1.9(VIF) ; port #RESET
AI_SCLK: U1.3(VIA) ; port SCLK
C2L1+: F7.1 Z1.8
C2L1-: F8.1 Z1.7
C2L2+: F5.1 Z1.6
C2L2-: F6.1 Z1.5
C2L3+: F3.1 Z1.4
C2L3-: F4.1 Z1.3
C2Lz+: F1.1 Z1.2
C2Lz-: F2.1 Z1.1
CS_I: U1.16(VOC) U2.39(#SS/HSA)
IL1+: C15.1 R21.1 U2.7(IAP)
IL1-: C16.1 R26.1 U2.8(IAN)
IL2+: C11.1 R15.1 U2.9(IBP)
IL2-: C14.1 R20.1 U2.12(IBN)
IL3+: C7.1 R8.1 U2.13(ICP)
IL3-: C8.1 R14.1 U2.14(ICN)
ILN+: C1.1 R1.1 U2.15(INP)
ILN-: C6.1 R6.1 U2.16(INN)
IRQ0_I: R7.1 U1.15(VID) U2.29(IRQ0)
IRQ1_I: R11.1 U2.32(IRQ1)
MISO_I: U1.13(VIE) U2.37(MISO/HSD)
MOSI_I: U1.17(VOB) U2.38(MOSI/SDA)
SCLK_I: U1.18(VOA) U2.36(SCLK/SCL)
UL1: C27.2 R35.1 R38.2 U2.23(VAP)
UL1Z: F11.2 R37.2
UL2: C26.2 R31.1 R34.2 U2.22(VBP)
UL2Z: F10.2 R33.2
UL3: C25.2 R27.1 R30.2 U2.19(VCP)
ULN: C25.1 C26.1 C27.1 C28.2 F12.2 R30.1 R34.1 R38.1 R39.2 U2.18(VN)
VC3_I: C17.2 C18.2 C19.2 C20.2 C21.2 C22.2 C23.2 C24.2 R7.2 R11.2 U1.14(VDD2) U1.20(VDD2) U2.2(PM0) U2.26(VDD) U3.2(Vout)
VC5_I: K1.4(OUT+) U3.3(Vin)
NetC2_2: C2.2 C3.2 U2.5(DVDD)
NetC4_2: C4.2 C5.2 U2.24(AVDD)
NetC9_2: C9.2 U2.27(CLKin) X1.1
NetC10_2: C10.2 U2.28(CLKout) X1.3
NetC12_2: C12.2 C13.2 U2.17(REFin/out)
NetF1_2: F1.2 R1.2 R2.1 R3.1
NetF2_2: F2.2 R4.1 R5.1 R6.2
NetF3_2: F3.2 R8.2 R9.1 R10.1
NetF4_2: F4.2 R12.1 R13.1 R14.2
NetF5_2: F5.2 R15.2 R16.1 R17.1
NetF6_2: F6.2 R18.1 R19.1 R20.2
NetF7_2: F7.2 R21.2 R22.1 R23.1
NetF8_2: F8.2 R24.1 R25.1 R26.2
NetF9_1: F9.1 Z2.7
NetF9_2: F9.2 R29.2
NetF10_1: F10.1 Z2.5
NetF11_1: F11.1 Z2.3
NetF12_1: F12.1 Z2.1
NetFX1_1: FX1.1 U2.35(CF3/HSCLK)
NetFX2_1: FX2.1 U2.34(CF2/HREADY)
NetR27_2: R27.2 R28.1
NetR28_2: R28.2 R29.1
NetR31_2: R31.2 R32.1
NetR32_2: R32.2 R33.1
NetR35_2: R35.2 R36.1
NetR36_2: R36.2 R37.1

Not connected (* = marked no-connect by the designer): U2 1(nc) 10(nc) 11(nc) 20(nc) 21(nc) 30(nc) 31(nc) 40(nc); Z2 2 4 6

### Layout directives
net class Class_U2: UL2Z
net class Class_U1: (no net found under the mark)
net class Class_U3: UL1Z

### Library data of the parts
C1 C6-C11 C14-C16 C25-C28 = CAP: Capacitor
C2-C5 C12 C13 C17-C23 = CAP
C24 = CapTantal
F1-F12 = KORALIK: Koralik ferrytowy
FX1 FX2 = PP_RT
K1 = DCDC_SIL
R1-R39 = RES3
U1 = ADUM7642: Dostawca: Mouser; Dostawca.Symbol: ADUM7642CRQZ
U2 = ADE7880
U3 = MCP1703T-3302E/CB: Dostawca: TME; Dostawca.Symbol: MCP1703T3302ECB
X1 = XTAL_32K_NX3215SA: Crystal 32.768kHz, 6pF, -+20PPM, R=50K, SMD; Manuf_1: NDK; Manuf_Part_1: NX3215SA 32.768KHz EXS00A-MU00525; Description: Crystal 32.768kHz, 6pF, -+20PPM, NDK only for ST, Type NX3215SA,  NDK Spec EXS00A-MU00525; ECCN_US/EU: EAR99/NEC; Ref St: 9157034; NDK Ref: X3101802; Provided: ST; Dostawca.Symbol: 32.768K-CFPX217; Dostawca: TME; Distrib: *; Order: NX3215SA 32.768KHz EXS00A-MU00525
Z1 = Header 8H: Header, 8-Pin, Right Angle; LatestRevisionDate: 17-Jul-2002; LatestRevisionNote: Re-released for DXP Platform.; Publisher: Altium Limited
Z2 = Header 7: Header, 7-Pin; LatestRevisionDate: 17-Jul-2002; LatestRevisionNote: Re-released for DXP Platform.; Publisher: Altium Limited

## Sheet DacAmpl.SchDoc
size A4
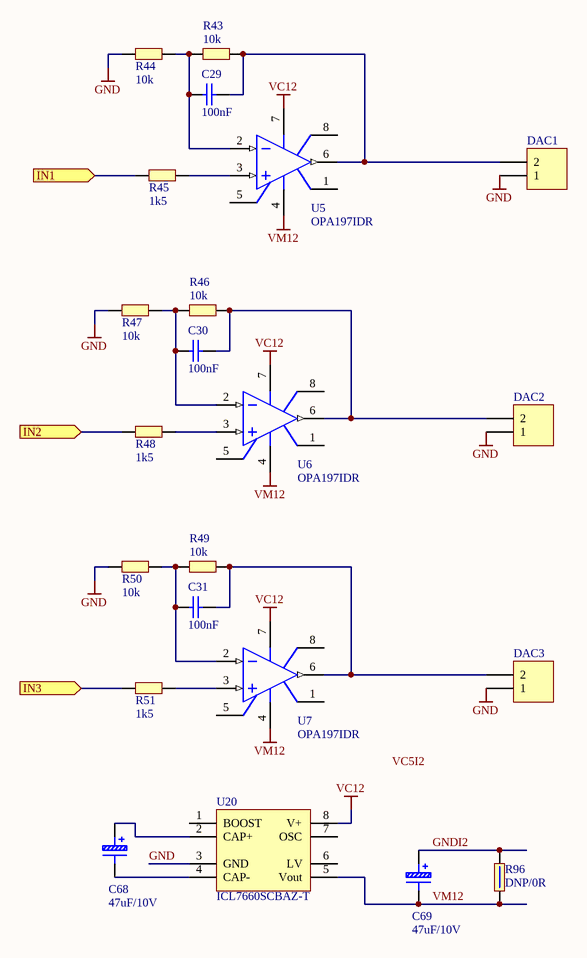
[diagram p7: DacAmpl.SchDoc]

### Parts
C29  100nF  [0603C]
C30  100nF  [0603C]
C31  100nF  [0603C]
C68  47uF/10V  [CAP_C]
C69  47uF/10V  [CAP_C]
DAC1  Header 2  [JST-B2B-XH-A]  (value not drawn)
DAC2  Header 2  [JST-B2B-XH-A]  (value not drawn)
DAC3  Header 2  [JST-B2B-XH-A]  (value not drawn)
R43  10k  [0603R]
R44  10k  [0603R]
R45  1k5  [0603R]
R46  10k  [0603R]
R47  10k  [0603R]
R48  1k5  [0603R]
R49  10k  [0603R]
R50  10k  [0603R]
R51  1k5  [0603R]
R96  DNP/0R  [0603R]
U5  OPA197IDR  [SO8]
U6  OPA197IDR  [SO8]
U7  OPA197IDR  [SO8]
U20  ICL7660SCBAZ-T  [SO8]

### Ports
IN1 (in), IN2 (in), IN3 (in)

### Nets
GND: DAC1.1 DAC2.1 DAC3.1 R44.1 R47.1 R50.1 U20.3(GND)
VC12: U5.7(V+) U6.7(V+) U7.7(V+) U20.8(V+)
VM12: C69.1 R96.2 U5.4(V-) U6.4(V-) U7.4(V-) U20.5(Vout)
DAC1_1: R45.1 ; port IN1
DAC1_2: R48.1 ; port IN2
DAC2: R51.1 ; port IN3
GNDI2: C69.2 R96.1
NetC29_1: C29.1 DAC1.2 R43.2 U5.6(OUT)
NetC29_2: C29.2 R43.1 R44.2 U5.2(IN-)
NetC30_1: C30.1 DAC2.2 R46.2 U6.6(OUT)
NetC30_2: C30.2 R46.1 R47.2 U6.2(IN-)
NetC31_1: C31.1 DAC3.2 R49.2 U7.6(OUT)
NetC31_2: C31.2 R49.1 R50.2 U7.2(IN-)
NetC68_1: C68.1 U20.4(CAP-)
NetC68_2: C68.2 U20.2(CAP+)
NetR45_2: R45.2 U5.3(IN+)
NetR48_2: R48.2 U6.3(IN+)
NetR51_2: R51.2 U7.3(IN+)

Not connected (* = marked no-connect by the designer): U5 1(OS_NUL) 5(OS_NUL) 8(TAB); U6 1(OS_NUL) 5(OS_NUL) 8(TAB); U7 1(OS_NUL) 5(OS_NUL) 8(TAB); U20 1(BOOST) 6(LV) 7(OSC)

### Notes on the sheet
- Labels drawn without touching a wire or pin: VC5I2

### Library data of the parts
C29-C31 = Cap_100nF_X7R_10%_0402: as C43 on sheet OTHERS; Revision: July-2002: Re-released for DXP Platform.; Value: 100nF; Order: CC0402KRX7R7BB104; Manuf_1: YAGEO
C68 C69 = CapTantal
DAC1-DAC3 = Header 2: Header, 2-Pin; LatestRevisionDate: 17-Jul-2002; LatestRevisionNote: Re-released for DXP Platform.; Publisher: Altium Limited
R43-R51 = RES3
R96 = RES3Z
U5-U7 = Op Amp: FET Operational Amplifier; Published: 8-Jun-2000; LatestRevisionDate: 17-Jul-2002; LatestRevisionNote: Re-released for DXP Platform.; DatasheetVersion: REV. B; PackageVersion: 1990; PackageReference: H-08A; Publisher: Altium Limited; PackageDescription: Can; 8 Leads; Pin Circle Dia. 5.08 mm; Lead Dia. 0.53 mm (max); ComponentLink1Description: Manufacturer Link; ComponentLink1URL: http://www.analog.com/
U20 = ICL7660

## Nets that join several sheets
GND: SterUni_V1 (17 pins), OTHERS (21 pins), OutControl (U16.9 Z5.3 Z5.4), StabImp (12 pins), I2C (10 pins), CAN (D1.3 R40.2 U4.2 Z3.3), AnalogInputs (K1.1 U1.2 U1.10), DacAmpl (7 pins)
VC3: SterUni_V1 (11 pins), OTHERS (17 pins), StabImp (C52.2 U18.2 U18.4), I2C (7 pins), AnalogInputs (U1.1 U1.7)
VC5: SterUni_V1 (P1.2 P1.11 P2.1 R87.2), OTHERS (B1.1), OutControl (Z5.1 Z5.2), StabImp (C54.2 U18.3 ZZ1.2), CAN (U4.3)
VC12: OutControl (U16.10 Z5.5 Z5.6), StabImp (5 pins), I2C (K2.2 K3.2), CAN (Z3.4), AnalogInputs (K1.2), DacAmpl (U5.7 U6.7 U7.7 U20.8)
/RST: SterUni_V1 (U19.7), OTHERS (C46.1 R70.2 RESET1.2)
AI_CS: SterUni_V1 (U19.55), AnalogInputs (U1.5)
AI_IRQ0: SterUni_V1 (U19.54), AnalogInputs (U1.6)
AI_MISO: SterUni_V1 (U19.57), AnalogInputs (U1.8)
AI_MOSI: SterUni_V1 (U19.58), AnalogInputs (U1.4)
AI_RESET: SterUni_V1 (U19.39), AnalogInputs (U1.9)
AI_SCLK: SterUni_V1 (U19.56), AnalogInputs (U1.3)
BUZZER: SterUni_V1 (U19.44), OTHERS (R77.2)
CAN_RX: SterUni_V1 (U19.61), CAN (U4.4)
CAN_TX: SterUni_V1 (U19.62), CAN (U4.1)
D_RXD: SterUni_V1 (U19.60), OTHERS (R73.2)
D_TXD: SterUni_V1 (U19.59), OTHERS (R72.2)
DAC1_1: SterUni_V1 (AX1.1 U19.18), DacAmpl (R45.1)
DAC1_2: SterUni_V1 (AX2.1 U19.19), DacAmpl (R48.1)
DAC2: SterUni_V1 (AX3.1 U19.20), DacAmpl (R51.1)
KEY1: SterUni_V1 (U19.17), OTHERS (C44.1 P3.1 R66.1)
KEY2: SterUni_V1 (U19.21), OTHERS (C45.1 P3.2 R74.1)
KEY3: SterUni_V1 (U19.22), OTHERS (C47.1 P3.3 R75.1)
KEY4: SterUni_V1 (U19.23), OTHERS (C48.1 P3.4 R69.1)
LED1: SterUni_V1 (U19.40), OTHERS (R81.2)
LED2: SterUni_V1 (U19.41), OTHERS (R82.2)
PK1: SterUni_V1 (U19.2), OutControl (L1.1)
PK2: SterUni_V1 (U19.3), OutControl (L2.1)
PK3: SterUni_V1 (U19.4), OutControl (L3.1)
PK4: SterUni_V1 (U19.6), OutControl (L4.1)
PK5: SterUni_V1 (U19.8), OutControl (L5.1)
PK6: SterUni_V1 (U19.9), OutControl (L6.1)
PK7: SterUni_V1 (U19.10), OutControl (L7.1)
PK8: SterUni_V1 (U19.11), OutControl (L8.1)
RES1: SterUni_V1 (U19.13), OTHERS (C50.1 INP12.2 R80.1)
RES2: SterUni_V1 (U19.14), OTHERS (C65.1 INP7.2 R94.1)
SCL: SterUni_V1 (U19.43), I2C (R54.2 U10.3 U11.3 U13.6)
SDA: SterUni_V1 (U19.42), I2C (R53.2 U10.2 U11.2 U13.5)
ST_GEN: SterUni_V1 (U19.5), OTHERS (R65.2)
SWCLK: SterUni_V1 (U19.50), OTHERS (R68.2 SWD1.3)
SWDIO: SterUni_V1 (U19.49), OTHERS (R64.2 SWD1.1)
TERMIK: SterUni_V1 (U19.12), OTHERS (C49.1 INP11.2 R79.1)